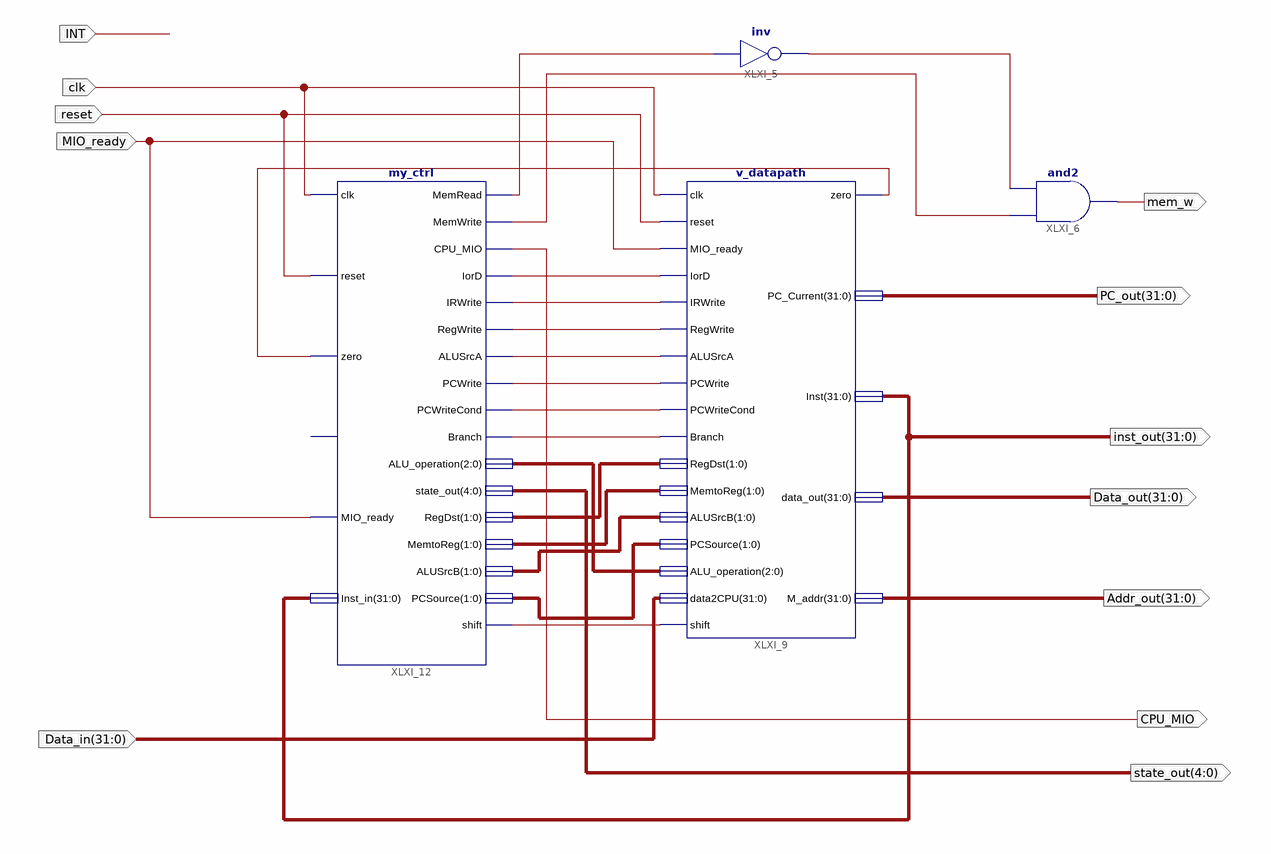
[diagram p0: schematic sheet 1]
// Xilinx ISE schematic MCPU.sch (kintex7) as structural Verilog: 4 symbols, 12 ports
module MCPU (
  input  clk,
  input  reset,
  input  MIO_ready,
  input  [31:0] Data_in,
  input  INT,
  output [31:0] inst_out,
  output [31:0] Addr_out,
  output CPU_MIO,
  output mem_w,
  output [4:0] state_out,
  output [31:0] Data_out,
  output [31:0] PC_out
);

  wire branch, XLXN_7, XLXN_8, XLXN_9, XLXN_10, XLXN_11, XLXN_12, XLXN_17, XLXN_39, XLXN_41, XLXN_42, XLXN_59;
  wire [1:0] XLXN_55, XLXN_56, XLXN_57, XLXN_58;
  wire [2:0] XLXN_54;

  not XLXI_5 (XLXN_42, XLXN_39);
  and XLXI_6 (mem_w, XLXN_41, XLXN_42);
  v_datapath XLXI_9 (
    .clk(clk), .reset(reset), .MIO_ready(MIO_ready), .IorD(XLXN_12), .IRWrite(XLXN_11), .RegWrite(XLXN_10),
    .ALUSrcA(XLXN_9), .PCWrite(XLXN_8), .PCWriteCond(XLXN_7), .Branch(branch), .RegDst(XLXN_55),
    .MemtoReg(XLXN_56), .ALUSrcB(XLXN_57), .PCSource(XLXN_58), .ALU_operation(XLXN_54), .data2CPU(Data_in),
    .zero(XLXN_17), .PC_Current(PC_out), .Inst(inst_out), .data_out(Data_out), .M_addr(Addr_out),
    .shift(XLXN_59));
  my_ctrl XLXI_12 (
    .clk(clk), .reset(reset), .zero(XLXN_17), .MIO_ready(MIO_ready), .Inst_in(inst_out), .MemRead(XLXN_39),
    .MemWrite(XLXN_41), .CPU_MIO(CPU_MIO), .IorD(XLXN_12), .IRWrite(XLXN_11), .RegWrite(XLXN_10),
    .ALUSrcA(XLXN_9), .PCWrite(XLXN_8), .PCWriteCond(XLXN_7), .Branch(branch), .ALU_operation(XLXN_54),
    .state_out(state_out), .RegDst(XLXN_55), .MemtoReg(XLXN_56), .ALUSrcB(XLXN_57), .PCSource(XLXN_58),
    .shift(XLXN_59));  // open: overflow
endmodule
